# EAGLE design MAX1168_breakout (EAGLE 9.0.0)
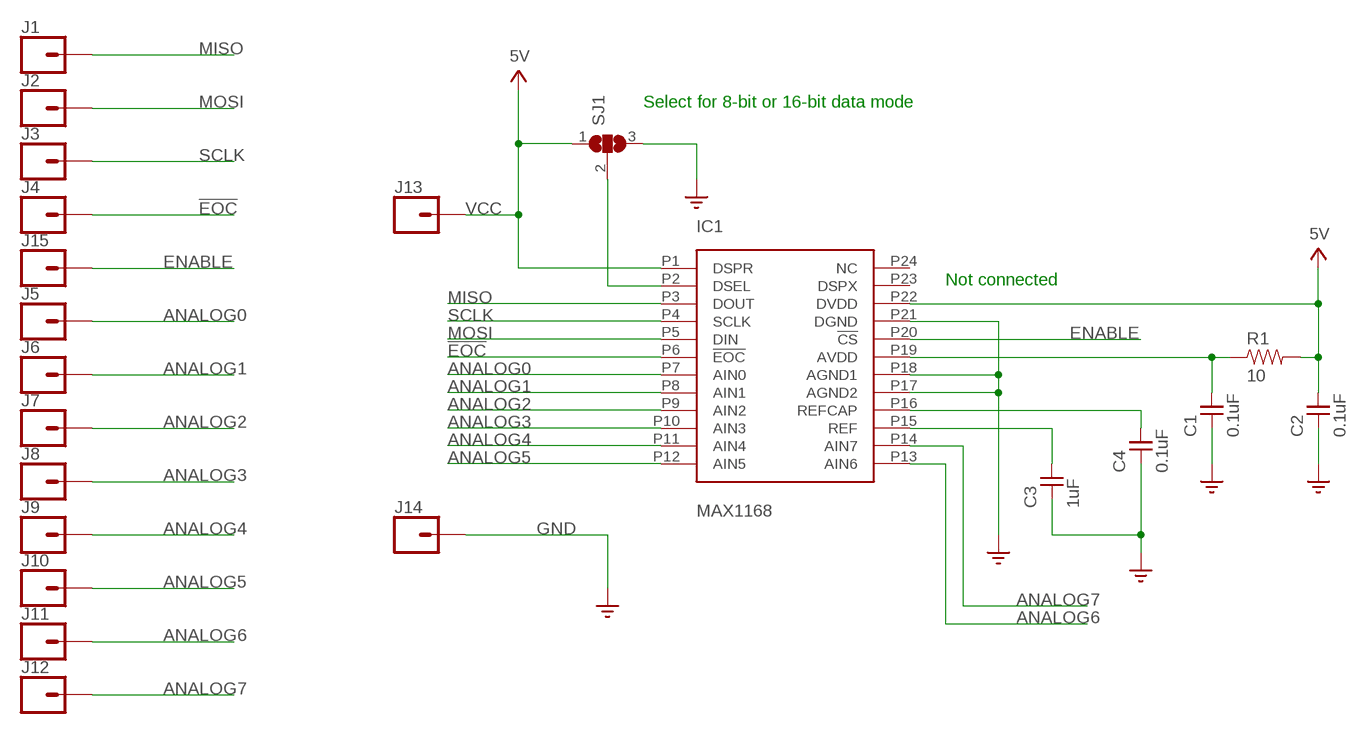
[diagram p0: schematic, sheet 1]

## Parts
C1  0.1uF  CAPACITOR0805  [0805]
C2  0.1uF  CAPACITOR0805  [0805]
C3  1uF  CAPACITOR0805  [0805]
C4  0.1uF  CAPACITOR0805  [0805]
IC1  MAX1168  [QSOP-24]
J1  CONN_01PTH_NO_SILK_YES_STOP  [1X01_NO_SILK]
J2  CONN_01PTH_NO_SILK_YES_STOP  [1X01_NO_SILK]
J3  CONN_01PTH_NO_SILK_YES_STOP  [1X01_NO_SILK]
J4  CONN_01PTH_NO_SILK_YES_STOP  [1X01_NO_SILK]
J5  CONN_01PTH_NO_SILK_YES_STOP  [1X01_NO_SILK]
J6  CONN_01PTH_NO_SILK_YES_STOP  [1X01_NO_SILK]
J7  CONN_01PTH_NO_SILK_YES_STOP  [1X01_NO_SILK]
J8  CONN_01PTH_NO_SILK_YES_STOP  [1X01_NO_SILK]
J9  CONN_01PTH_NO_SILK_YES_STOP  [1X01_NO_SILK]
J10  CONN_01PTH_NO_SILK_YES_STOP  [1X01_NO_SILK]
J11  CONN_01PTH_NO_SILK_YES_STOP  [1X01_NO_SILK]
J12  CONN_01PTH_NO_SILK_YES_STOP  [1X01_NO_SILK]
J13  CONN_01PTH_NO_SILK_YES_STOP  [1X01_NO_SILK]
J14  CONN_01PTH_NO_SILK_YES_STOP  [1X01_NO_SILK]
J15  CONN_01PTH_NO_SILK_YES_STOP  [1X01_NO_SILK]
R1  10  RESISTORSMD0805  [0805]
SJ1  SJ2W  [SJ_2]

## Nets
!EOC: IC1.P6(!EOC) J4.1
ANALOG0: IC1.P7(AIN0) J5.1
ANALOG1: IC1.P8(AIN1) J6.1
ANALOG2: IC1.P9(AIN2) J7.1
ANALOG3: IC1.P10(AIN3) J8.1
ANALOG4: IC1.P11(AIN4) J9.1
ANALOG5: IC1.P12(AIN5) J10.1
ANALOG6: IC1.P13(AIN6) J11.1
ANALOG7: IC1.P14(AIN7) J12.1
ENABLE: IC1.P20(!CS) J15.1
GND: C1.1 C2.1 C3.1 C4.1 IC1.P17(AGND2) IC1.P18(AGND1) IC1.P21(DGND) J14.1 SJ1.3 ; supply symbol labelled DGND
MISO: IC1.P3(DOUT) J1.1
MOSI: IC1.P5(DIN) J2.1
N$1: IC1.P2(DSEL) SJ1.2
N$2: C3.2 IC1.P15(REF)
N$3: C1.2 IC1.P19(AVDD) R1.1
N$4: C4.2 IC1.P16(REFCAP)
SCLK: IC1.P4(SCLK) J3.1
VCC: C2.2 IC1.P1(DSPR) IC1.P22(DVDD) J13.1 R1.2 SJ1.1 ; supply symbol labelled 5V
Unconnected: IC1.P23(DSPX) IC1.P24(NC)

## Notes on the sheet
- Select for 8-bit or 16-bit data mode
- Not connected

## Library data of the parts
C1-C4 = thomas:CAPACITOR: This is a capacitor
IC1 = thomas:MAX1168: The MAX1168 is an 8-channel 16-bit ADC
J1-J15 = SparkFun-Connectors:CONN_01: Single connection point. Often used as Generic Header-pin footprint for 0.1 inch spaced/style header connections On any of the 0.1 inch spaced packages, you can populate with these: Break Away Headers - Straight <https://www.sparkfun.com/products/116> (PRT-00116) Break Away Male Headers - Right Angle <https://www.sparkfun.com/products/553> (PRT-00553) Female Headers <https://www.sparkfun.com/products/115> (PRT-00115) Break Away Headers - Machine Pin <https://www.sparkfun.com/products/117> (PRT-00117) Break Away Female Headers - Swiss Machine Pin <https://www.sparkfun.com/products/743> (PRT-00743) This device is also useful as a general connection point to wire up your design to another part of your project. Our various solder wires solder well into these plated through hole pads. Hook-Up Wire - Assortment (Stranded, 22 AWG) <https://www.sparkfun.com/products/11375> (PRT-11375) Hook-Up Wire - Assortment (Solid Core, 22 AWG) <https://www.sparkfun.com/products/11367> (PRT-11367) View the entire wire category on our website here <https://www.sparkfun.com/categories/141> Special notes: SMTSO-256-ET is a "flush mount" nut for a 4-40 screw. We mostly use this on specialty testbeds; it is a nice way to connect hardware to your PCB at an adjustable hieght. Also note, the SNAP packages are for using a snappable style connector. We sell a baggie of snaps and they are also used on two LilyPad designs: Snap Assortment - 30 pack (male and female) <https://www.sparkfun.com/products/11347> (DEV-11347) LilyPad Arduino SimpleSnap <https://www.sparkfun.com/products/10941> (DEV-10941) LilyPad SimpleSnap Protoboard <https://www.sparkfun.com/products/10940> (DEV-10940)
R1 = thomas:RESISTOR: This is a resistor
SJ1 = jumper:SJ2W: SMD solder JUMPER

## Board
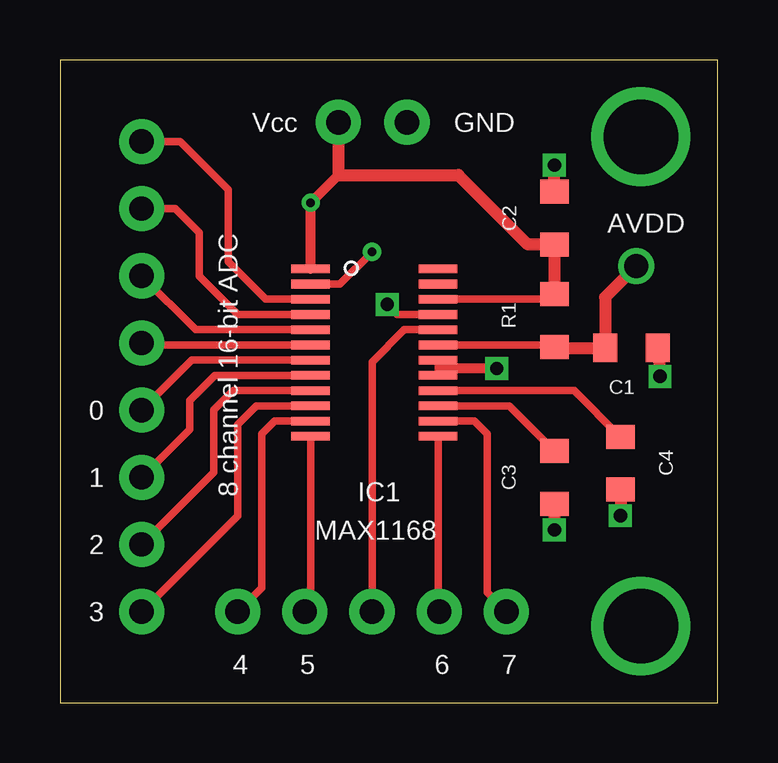
[diagram p1: board, top side]
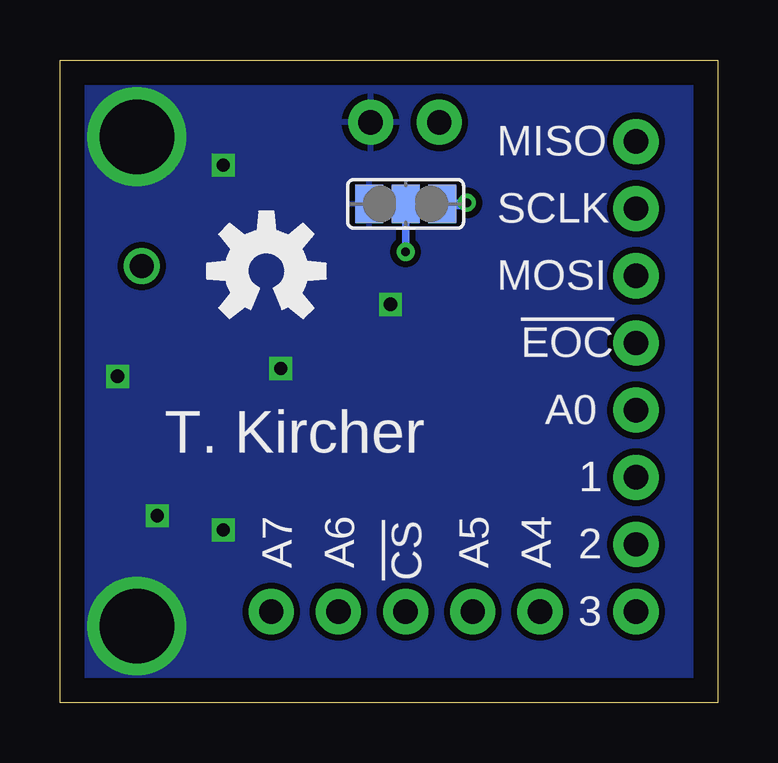
[diagram p2: board, bottom side, seen from below]

Size 27.4 x 26.8 mm. Coordinates in mm from the lower left corner, seen from the top.
Outline: 0,0 27.4,0 27.4,26.8 0,26.8 0,0
Copper layers (1*16): Top 0.035mm / dielectric 1.5mm / Bottom 0.035mm
Design rules "default": minimum track width 6mil, minimum drill 0.35mm, track to track 6mil, track to pad 6mil, pad to pad 6mil, via to via 6mil, smd to smd 6mil, copper to edge 40mil, drill to drill 6mil, minimum pad ring 10mil, minimum via ring 8mil, stop-mask expansion 4mil, vias tented up to drill 0mil, thermal gap 10mil

### Footprints (pad centres in the part's own frame; a part is rotated, then mirrored left to right if it is on the bottom)
0805 = smd 1 x 1.2: 1 -1.1,0; 2 1.1,0
QSOP-24 = smd 1.6 x 0.36: P1 -2.655,3.493; P2 -2.655,2.857; P3 -2.655,2.223; P4 -2.655,1.587; P5 -2.655,0.953; P6 -2.655,0.318; P7 -2.655,-0.318; P8 -2.655,-0.953; P9 -2.655,-1.587; P10 -2.655,-2.223; P11 -2.655,-2.857; P12 -2.655,-3.493; P13 2.655,-3.493; P14 2.655,-2.857; P15 2.655,-2.223; P16 2.655,-1.587; P17 2.655,-0.953; P18 2.655,-0.318; P19 2.655,0.318; P20 2.655,0.953; P21 2.655,1.587; P22 2.655,2.223; P23 2.655,2.857; P24 2.655,3.493
1X01_NO_SILK = drill 1.016 pad 1.88: 1 0,0
SJ_2 = smd 1.168 x 1.6: 1 -1.524,0; 2 0,0; 3 1.524,0

### Placement (x,y rotation side)
C1  23.81,14.8 180 top
C2  20.6,20.21 270 top
C3  20.6,9.39 90 top
C4  23.35,9.99 90 top
IC1  13.1,14.6 0 top
J1  3.4,23.4 0 top
J2  3.4,17.8 0 top
J3  3.4,20.6 0 top
J4  3.4,15 0 top
J5  3.4,12.2 0 top
J6  3.4,9.4 0 top
J7  3.4,6.6 0 top
J8  3.4,3.8 0 top
J9  7.4,3.8 0 top
J10  10.2,3.8 0 top
J11  15.8,3.8 0 top
J12  18.6,3.8 0 top
J13  11.6,24.2 0 top
J14  14.46,24.2 0 top
J15  13,3.8 0 top
R1  20.6,15.94 90 top
SJ1  13,20.8 180 bottom
U$9  [OSHW-LOGO-M]  18.8,18 0 bottom

### Tracks (layer width: path | path; a pad name or v marks a point on that pad's centre or on a via)
!EOC
  Top 0.305: IC1.P6 3.48,14.92 J4.1
ANALOG0
  Top 0.305: IC1.P7 5.48,14.28 J5.1
ANALOG1
  Top 0.305: J6.1 5.4,11.4 5.4,12.6 6.45,13.65 IC1.P8
ANALOG2
  Top 0.305: J7.1 6.4,9.6 6.4,12.2 7.21,13.01 IC1.P9
ANALOG3
  Top 0.305: J8.1 7.4,7.8 7.4,11.6 8.18,12.38 IC1.P10
ANALOG4
  Top 0.305: J9.1 8.4,4.8 8.4,11.2 8.94,11.74 IC1.P11
ANALOG5
  Top 0.305: IC1.P12 10.45,4.16 J10.1
ANALOG6
  Top 0.305: IC1.P13 15.76,3.95 J11.1
ANALOG7
  Top 0.305: IC1.P14 17.26,11.74 17.8,11.2 17.8,4.6 J12.1
ENABLE
  Top 0.305: IC1.P20 14.35,15.55 13,14.2 J15.1
GND  (via drill 0.55, 3.1)
  Top 0.305: IC1.P21 14.05,16.19 v13.63,16.61 | IC1.P18 15.76,14 | 15.76,14 IC1.P17 | 15.82,13.94 15.76,14
  Top 0.406: v18.2,13.94 15.82,13.94
  Top 0.508: C4.1 23.36,8.14 v23.35,7.8 | C3.1 v20.6,7.21 | C2.1 20.59,22.37 v20.6,22.41 | C1.1 v25,13.61
  other vias: 24.2,23.6 24.2,3.2
  pour Bottom (isolate 0.254): 0.6,26 26.6,26 26.6,0.8 0.6,0.8
MISO
  Top 0.305: J1.1 5,23.4 7,21.4 7,18.4 8.58,16.82 IC1.P3
MOSI
  Top 0.305: IC1.P5 5.65,15.55 J2.1
N$1  (via drill 0.35)
  Top 0.305: IC1.P2 11.66,17.46 v13,18.8
  Bottom 0.305: SJ1.2 v13,18.8
N$2
  Top 0.305: IC1.P15 18.71,12.38 C3.2
N$3  (via drill 1)
  Top 0.305: IC1.P19 20.52,14.92 R1.1
  Top 0.508: R1.1 20.64,14.8 C1.2 22.71,16.91 v24,18.2
N$4
  Top 0.305: IC1.P16 21.42,13.01 C4.2
SCLK
  Top 0.305: J3.1 4.8,20.6 5.8,19.6 5.8,17.8 7.41,16.19 IC1.P4
VCC  (via drill 0.35)
  Top 0.305: IC1.P22 20.38,16.82 R1.2
  Top 0.406: IC1.P1 v10.45,20.84 11.6,22
  Top 0.508: R1.2 C2.2 19.49,19.11 16.6,22 11.6,22 J13.1
  Bottom 0.406: SJ1.1 10.49,20.8 v10.45,20.84
  Bottom 0.508: 11.6,20.88 SJ1.1

### Text on the board
tNames: Vcc | GND | AVDD | 0 | 1 | 8 channel 16-bit ADC | IC1 | 2 | MAX1168 | 3 | 4 | 5 | 6 | 7
bNames: MISO | SCLK | MOSI | !EOC | T. Kircher | A0 | 1 | A4 | A5 | !CS | A6 | A7 | 2 | 3